# EAGLE schematic esp-module-cu (EAGLE 9.6.2)
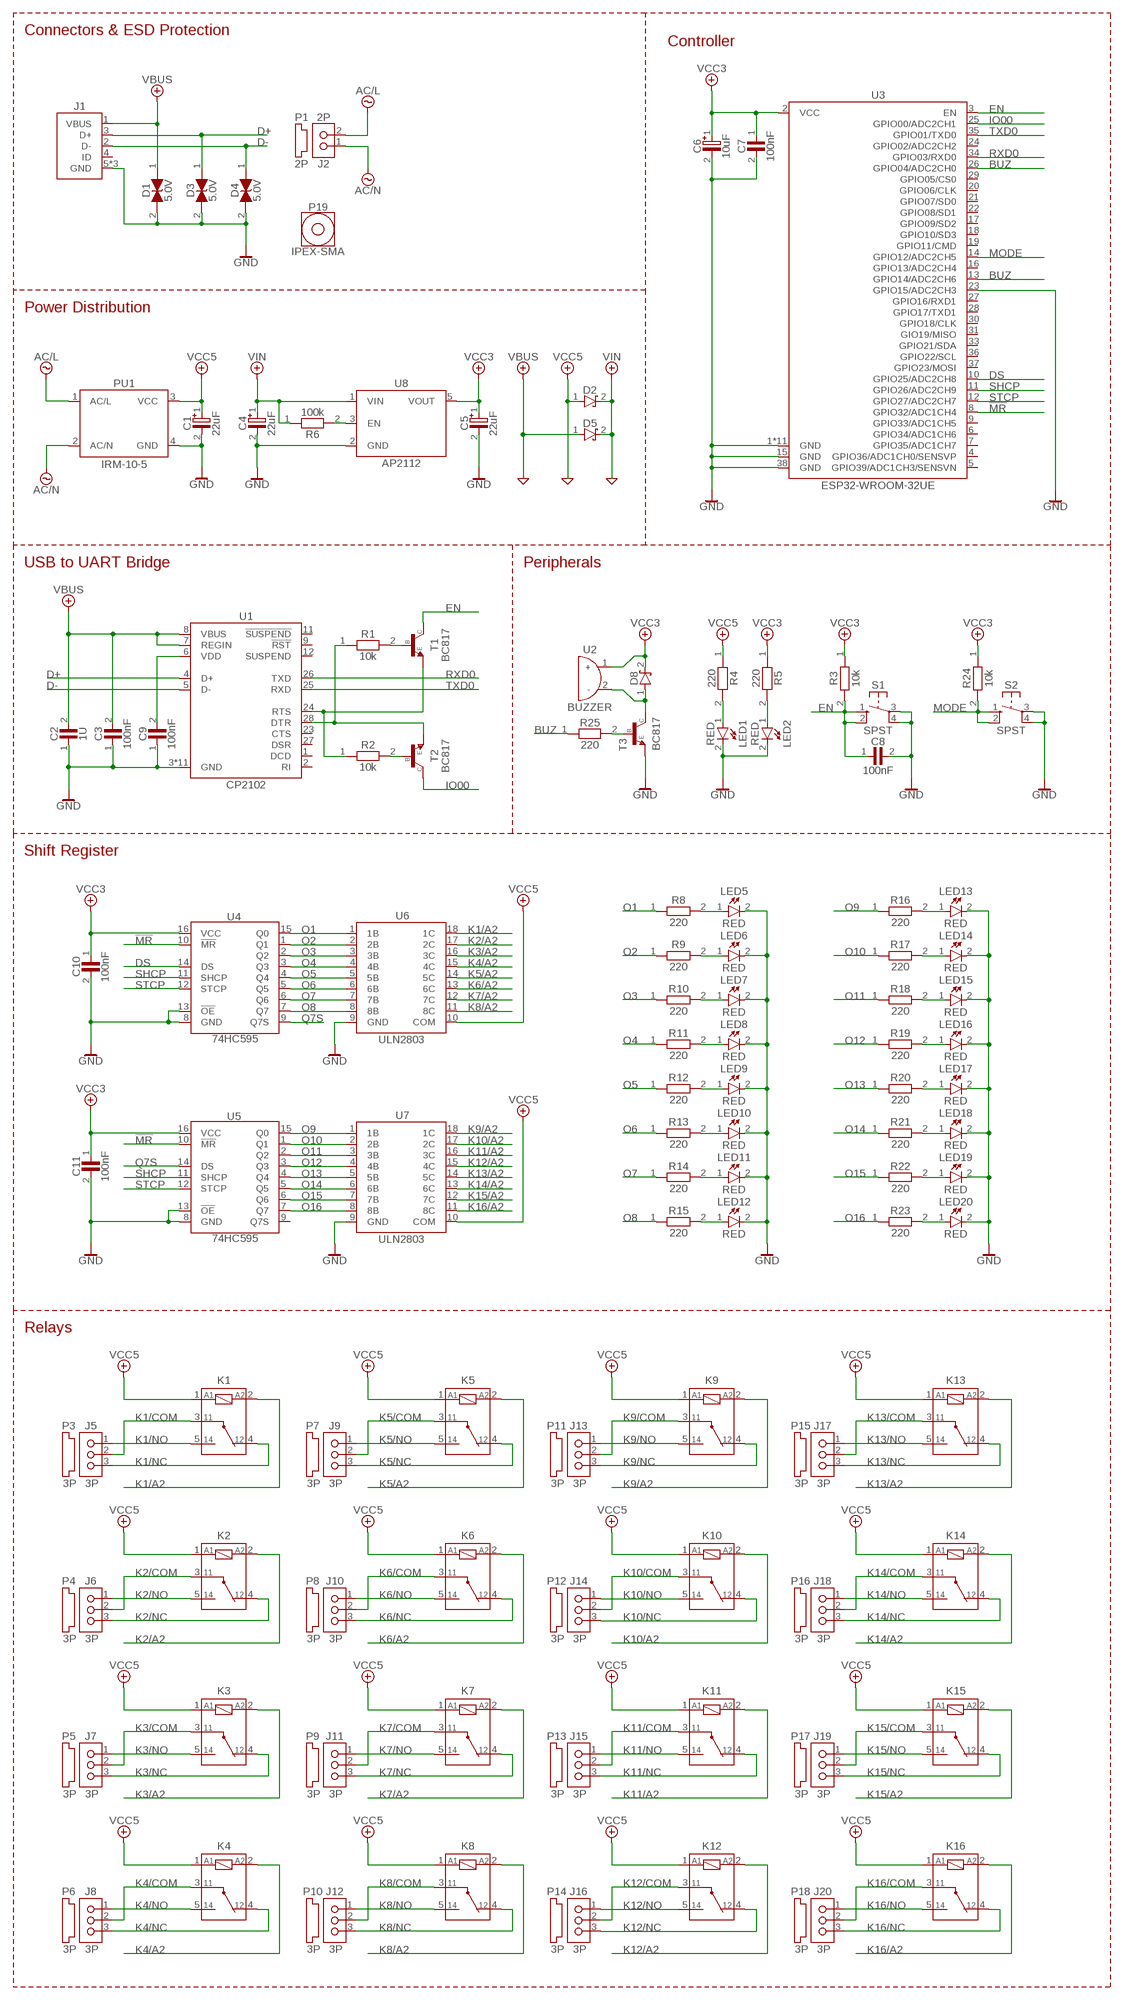
[diagram p0: schematic, sheet 1]

## Parts
C1  22uF  CAPACITOR-TANTALUM-22U-I1206-M3216  [I1206-M3216-D]
C2  1U  CAPACITOR-CERAMIC-1U-I0805-M2012  [I0805-M2012-C]
C3  100nF  CAPACITOR-CERAMIC-100N-I0805-M2012  [I0805-M2012-C]
C4  22uF  CAPACITOR-TANTALUM-22U-I1206-M3216  [I1206-M3216-D]
C5  22uF  CAPACITOR-TANTALUM-22U-I1206-M3216  [I1206-M3216-D]
C6  10uF  CAPACITOR-TANTALUM-10U-I1206-M3216  [I1206-M3216-D]
C7  100nF  CAPACITOR-CERAMIC-100N-I0805-M2012  [I0805-M2012-C]
C8  100nF  CAPACITOR-CERAMIC-100N-I0805-M2012  [I0805-M2012-C]
C9  100nF  CAPACITOR-CERAMIC-100N-I0805-M2012  [I0805-M2012-C]
C10  100nF  CAPACITOR-CERAMIC-100N-I0805-M2012  [I0805-M2012-C]
C11  100nF  CAPACITOR-CERAMIC-100N-I0805-M2012  [I0805-M2012-C]
D1  5.0V  ZENER-BI-5.0V-SOD-523  [SOD-523]
D2  30V  SCHOTTKY-30V-SOD-323  [SOD-323]
D3  5.0V  ZENER-BI-5.0V-SOD-523  [SOD-523]
D4  5.0V  ZENER-BI-5.0V-SOD-523  [SOD-523]
D5  30V  SCHOTTKY-30V-SOD-323  [SOD-323]
D8  30V  SCHOTTKY-30V-SOD-323  [SOD-323]
J1  USB-A-MICRO-TOP  [USB-A-MICRO-TOP]
J2  2P  HEADER-02P-1R-KF2EDGV-5.08-2P  [KF2EDGV-5.08-2P]
J5  3P  HEADER-03P-1R-KF2EDGV-5.08-3P  [KF2EDGV-5.08-3P]
J6  3P  HEADER-03P-1R-KF2EDGV-5.08-3P  [KF2EDGV-5.08-3P]
J7  3P  HEADER-03P-1R-KF2EDGV-5.08-3P  [KF2EDGV-5.08-3P]
J8  3P  HEADER-03P-1R-KF2EDGV-5.08-3P  [KF2EDGV-5.08-3P]
J9  3P  HEADER-03P-1R-KF2EDGV-5.08-3P  [KF2EDGV-5.08-3P]
J10  3P  HEADER-03P-1R-KF2EDGV-5.08-3P  [KF2EDGV-5.08-3P]
J11  3P  HEADER-03P-1R-KF2EDGV-5.08-3P  [KF2EDGV-5.08-3P]
J12  3P  HEADER-03P-1R-KF2EDGV-5.08-3P  [KF2EDGV-5.08-3P]
J13  3P  HEADER-03P-1R-KF2EDGV-5.08-3P  [KF2EDGV-5.08-3P]
J14  3P  HEADER-03P-1R-KF2EDGV-5.08-3P  [KF2EDGV-5.08-3P]
J15  3P  HEADER-03P-1R-KF2EDGV-5.08-3P  [KF2EDGV-5.08-3P]
J16  3P  HEADER-03P-1R-KF2EDGV-5.08-3P  [KF2EDGV-5.08-3P]
J17  3P  HEADER-03P-1R-KF2EDGV-5.08-3P  [KF2EDGV-5.08-3P]
J18  3P  HEADER-03P-1R-KF2EDGV-5.08-3P  [KF2EDGV-5.08-3P]
J19  3P  HEADER-03P-1R-KF2EDGV-5.08-3P  [KF2EDGV-5.08-3P]
J20  3P  HEADER-03P-1R-KF2EDGV-5.08-3P  [KF2EDGV-5.08-3P]
K1  5V  RELAY-SPDT-5V-SRD  [SRD]
K2  5V  RELAY-SPDT-5V-SRD  [SRD]
K3  5V  RELAY-SPDT-5V-SRD  [SRD]
K4  5V  RELAY-SPDT-5V-SRD  [SRD]
K5  5V  RELAY-SPDT-5V-SRD  [SRD]
K6  5V  RELAY-SPDT-5V-SRD  [SRD]
K7  5V  RELAY-SPDT-5V-SRD  [SRD]
K8  5V  RELAY-SPDT-5V-SRD  [SRD]
K9  5V  RELAY-SPDT-5V-SRD  [SRD]
K10  5V  RELAY-SPDT-5V-SRD  [SRD]
K11  5V  RELAY-SPDT-5V-SRD  [SRD]
K12  5V  RELAY-SPDT-5V-SRD  [SRD]
K13  5V  RELAY-SPDT-5V-SRD  [SRD]
K14  5V  RELAY-SPDT-5V-SRD  [SRD]
K15  5V  RELAY-SPDT-5V-SRD  [SRD]
K16  5V  RELAY-SPDT-5V-SRD  [SRD]
LED1  RED  LED-RED-I0805-M2012  [I0805-M2012-D]
LED2  RED  LED-RED-I0805-M2012  [I0805-M2012-D]
LED5  RED  LED-RED-I0805-M2012  [I0805-M2012-D]
LED6  RED  LED-RED-I0805-M2012  [I0805-M2012-D]
LED7  RED  LED-RED-I0805-M2012  [I0805-M2012-D]
LED8  RED  LED-RED-I0805-M2012  [I0805-M2012-D]
LED9  RED  LED-RED-I0805-M2012  [I0805-M2012-D]
LED10  RED  LED-RED-I0805-M2012  [I0805-M2012-D]
LED11  RED  LED-RED-I0805-M2012  [I0805-M2012-D]
LED12  RED  LED-RED-I0805-M2012  [I0805-M2012-D]
LED13  RED  LED-RED-I0805-M2012  [I0805-M2012-D]
LED14  RED  LED-RED-I0805-M2012  [I0805-M2012-D]
LED15  RED  LED-RED-I0805-M2012  [I0805-M2012-D]
LED16  RED  LED-RED-I0805-M2012  [I0805-M2012-D]
LED17  RED  LED-RED-I0805-M2012  [I0805-M2012-D]
LED18  RED  LED-RED-I0805-M2012  [I0805-M2012-D]
LED19  RED  LED-RED-I0805-M2012  [I0805-M2012-D]
LED20  RED  LED-RED-I0805-M2012  [I0805-M2012-D]
P1  2P  CONNECTOR-02P-1R-KF2EDGK-5.08  [CONNECTOR-DEFAULT]
P3  3P  CONNECTOR-03P-1R-KF2EDGK-5.08  [CONNECTOR-DEFAULT]
P4  3P  CONNECTOR-03P-1R-KF2EDGK-5.08  [CONNECTOR-DEFAULT]
P5  3P  CONNECTOR-03P-1R-KF2EDGK-5.08  [CONNECTOR-DEFAULT]
P6  3P  CONNECTOR-03P-1R-KF2EDGK-5.08  [CONNECTOR-DEFAULT]
P7  3P  CONNECTOR-03P-1R-KF2EDGK-5.08  [CONNECTOR-DEFAULT]
P8  3P  CONNECTOR-03P-1R-KF2EDGK-5.08  [CONNECTOR-DEFAULT]
P9  3P  CONNECTOR-03P-1R-KF2EDGK-5.08  [CONNECTOR-DEFAULT]
P10  3P  CONNECTOR-03P-1R-KF2EDGK-5.08  [CONNECTOR-DEFAULT]
P11  3P  CONNECTOR-03P-1R-KF2EDGK-5.08  [CONNECTOR-DEFAULT]
P12  3P  CONNECTOR-03P-1R-KF2EDGK-5.08  [CONNECTOR-DEFAULT]
P13  3P  CONNECTOR-03P-1R-KF2EDGK-5.08  [CONNECTOR-DEFAULT]
P14  3P  CONNECTOR-03P-1R-KF2EDGK-5.08  [CONNECTOR-DEFAULT]
P15  3P  CONNECTOR-03P-1R-KF2EDGK-5.08  [CONNECTOR-DEFAULT]
P16  3P  CONNECTOR-03P-1R-KF2EDGK-5.08  [CONNECTOR-DEFAULT]
P17  3P  CONNECTOR-03P-1R-KF2EDGK-5.08  [CONNECTOR-DEFAULT]
P18  3P  CONNECTOR-03P-1R-KF2EDGK-5.08  [CONNECTOR-DEFAULT]
P19  IPEX-SMA  [SMA]
PU1  IRM-10-5  POWER-SUPPLY-5V-IRM-10  [IRM-10]
R1  10k  RESISTOR-10K-I0805-M2012  [I0805-M2012-R]
R2  10k  RESISTOR-10K-I0805-M2012  [I0805-M2012-R]
R3  10k  RESISTOR-10K-I0805-M2012  [I0805-M2012-R]
R4  220  RESISTOR-220-I0805-M2012  [I0805-M2012-R]
R5  220  RESISTOR-220-I0805-M2012  [I0805-M2012-R]
R6  100k  RESISTOR-100K-I0805-M2012  [I0805-M2012-R]
R8  220  RESISTOR-220-I0805-M2012  [I0805-M2012-R]
R9  220  RESISTOR-220-I0805-M2012  [I0805-M2012-R]
R10  220  RESISTOR-220-I0805-M2012  [I0805-M2012-R]
R11  220  RESISTOR-220-I0805-M2012  [I0805-M2012-R]
R12  220  RESISTOR-220-I0805-M2012  [I0805-M2012-R]
R13  220  RESISTOR-220-I0805-M2012  [I0805-M2012-R]
R14  220  RESISTOR-220-I0805-M2012  [I0805-M2012-R]
R15  220  RESISTOR-220-I0805-M2012  [I0805-M2012-R]
R16  220  RESISTOR-220-I0805-M2012  [I0805-M2012-R]
R17  220  RESISTOR-220-I0805-M2012  [I0805-M2012-R]
R18  220  RESISTOR-220-I0805-M2012  [I0805-M2012-R]
R19  220  RESISTOR-220-I0805-M2012  [I0805-M2012-R]
R20  220  RESISTOR-220-I0805-M2012  [I0805-M2012-R]
R21  220  RESISTOR-220-I0805-M2012  [I0805-M2012-R]
R22  220  RESISTOR-220-I0805-M2012  [I0805-M2012-R]
R23  220  RESISTOR-220-I0805-M2012  [I0805-M2012-R]
R24  10k  RESISTOR-10K-I0805-M2012  [I0805-M2012-R]
R25  220  RESISTOR-220-I0805-M2012  [I0805-M2012-R]
S1  SPST  SWITCH-12V-50MA  [SMD-SW-4]
S2  SPST  SWITCH-12V-50MA  [SMD-SW-4]
T1  BC817  TRANSISTOR-NPN-SOT-23-3  [SOT-23-3]
T2  BC817  TRANSISTOR-NPN-SOT-23-3  [SOT-23-3]
T3  BC817  TRANSISTOR-NPN-SOT-23-3  [SOT-23-3]
U1  CP2102  CP2102-QFN-28  [QFN-28]
U2  BUZZER  [SMD-BUZZER]
U3  ESP32-WROOM-32UE  [ESP32-WROOM-32UE]
U4  74HC595  74HC595-SOIC-16  [SOIC-16]
U5  74HC595  74HC595-SOIC-16  [SOIC-16]
U6  ULN2803  ULN2803A-SOIC-18  [SOIC-18]
U7  ULN2803  ULN2803A-SOIC-18  [SOIC-18]
U8  AP2112  AP2112-SOT-25-5  [SOT-25-5]

## Nets
!MR: U3.8(GPIO32/ADC1CH4) U4.10(!MR) U5.10(!MR)
APEN: R6.2 U8.3(EN)
BUZ: R25.1 U3.13(GPIO14/ADC2CH6) U3.26(GPIO04/ADC2CH0)
BZB: R25.2 T3.1(B)
BZC: D8.1(A) T3.3(C) U2.2(-)
D+: D3.1(A) J1.3(D+) U1.4(D+)
D-: D4.1(A) J1.2(D-) U1.5(D-)
DS: U3.10(GPIO25/ADC2CH8) U4.14(DS)
DTR1: R1.1 T2.2(E) U1.28(DTR)
DTRT1: R1.2 T1.1(B)
EN: C8.1 R3.2 S1.1 S1.2 T1.3(C) U3.3(EN)
GND: C1.2(-) C2.1 C3.1 C4.2(-) C5.2(-) C6.2(-) C7.2 C8.2 C9.1 C10.2 C11.2 D1.2(C) D3.2(C) D4.2(C) J1.5(GND) J1.6(GND) J1.7(GND) LED1.2(C) LED2.2(C) LED5.2(C) LED6.2(C) LED7.2(C) LED8.2(C) LED9.2(C) LED10.2(C) LED11.2(C) LED12.2(C) LED13.2(C) LED14.2(C) LED15.2(C) LED16.2(C) LED17.2(C) LED18.2(C) LED19.2(C) LED20.2(C) PU1.4(GND) S1.3 S1.4 S2.3 S2.4 T3.2(E) U1.3(GND) U1.29(GND) U1.30(GND) U1.31(GND) U1.32(GND) U1.33(GND) U1.34(GND) U1.35(GND) U1.36(GND) U1.37(GND) U1.38(GND) U3.1(GND) U3.15(GND) U3.23(GPIO15/ADC2CH3) U3.38(GND) U3.39(GND) U3.40(GND) U3.41(GND) U3.42(GND) U3.43(GND) U3.44(GND) U3.45(GND) U3.46(GND) U3.47(GND) U3.48(GND) U4.8(GND) U4.13(!OE) U5.8(GND) U5.13(!OE) U6.9(GND) U7.9(GND) U8.2(GND)
IO00: T2.3(C) U3.25(GPIO00/ADC2CH1)
K1/A2: K1.2(A2) U6.18(1C)
K1/COM: J5.2 K1.3
K1/NC: J5.3 K1.4
K1/NO: J5.1 K1.5
K1LED: LED5.1(A) R8.2
K2/A2: K2.2(A2) U6.17(2C)
K2/COM: J6.2 K2.3
K2/NC: J6.3 K2.4
K2/NO: J6.1 K2.5
K2LED1: LED6.1(A) R9.2
K3/A2: K3.2(A2) U6.16(3C)
K3/COM: J7.2 K3.3
K3/NC: J7.3 K3.4
K3/NO: J7.1 K3.5
K3LED1: LED7.1(A) R10.2
K4/A2: K4.2(A2) U6.15(4C)
K4/COM: J8.2 K4.3
K4/NC: J8.3 K4.4
K4/NO: J8.1 K4.5
K4LED1: LED8.1(A) R11.2
K5/A2: K5.2(A2) U6.14(5C)
K5/COM: J9.2 K5.3
K5/NC: J9.3 K5.4
K5/NO: J9.1 K5.5
K5LED1: LED9.1(A) R12.2
K6/A2: K6.2(A2) U6.13(6C)
K6/COM: J10.2 K6.3
K6/NC: J10.3 K6.4
K6/NO: J10.1 K6.5
K6LED1: LED10.1(A) R13.2
K7/A2: K7.2(A2) U6.12(7C)
K7/COM: J11.2 K7.3
K7/NC: J11.3 K7.4
K7/NO: J11.1 K7.5
K7LED1: LED11.1(A) R14.2
K8/A2: K8.2(A2) U6.11(8C)
K8/COM: J12.2 K8.3
K8/NC: J12.3 K8.4
K8/NO: J12.1 K8.5
K8LED1: LED12.1(A) R15.2
K9/A2: K9.2(A2) U7.18(1C)
K9/COM: J13.2 K9.3
K9/NC: J13.3 K9.4
K9/NO: J13.1 K9.5
K09LED: LED13.1(A) R16.2
K10/A2: K10.2(A2) U7.17(2C)
K10/COM: J14.2 K10.3
K10/NC: J14.3 K10.4
K10/NO: J14.1 K10.5
K10LED: LED14.1(A) R17.2
K11/A2: K11.2(A2) U7.16(3C)
K11/COM: J15.2 K11.3
K11/NC: J15.3 K11.4
K11/NO: J15.1 K11.5
K11LED: LED15.1(A) R18.2
K12/A2: K12.2(A2) U7.15(4C)
K12/COM: J16.2 K12.3
K12/NC: J16.3 K12.4
K12/NO: J16.1 K12.5
K12LED: LED16.1(A) R19.2
K13/A2: K13.2(A2) U7.14(5C)
K13/COM: J17.2 K13.3
K13/NC: J17.3 K13.4
K13/NO: J17.1 K13.5
K13LED: LED17.1(A) R20.2
K14/A2: K14.2(A2) U7.13(6C)
K14/COM: J18.2 K14.3
K14/NC: J18.3 K14.4
K14/NO: J18.1 K14.5
K14LED: LED18.1(A) R21.2
K15/A2: K15.2(A2) U7.12(7C)
K15/COM: J19.2 K15.3
K15/NC: J19.3 K15.4
K15/NO: J19.1 K15.5
K15LED: LED19.1(A) R22.2
K16/A2: K16.2(A2) U7.11(8C)
K16/COM: J20.2 K16.3
K16/NC: J20.3 K16.4
K16/NO: J20.1 K16.5
K16LED: LED20.1(A) R23.2
L: J2.2 PU1.1(AC/L) ; supply symbol labelled AC/L
MODE: R24.2 S2.1 S2.2 U3.14(GPIO12/ADC2CH5)
N: J2.1 PU1.2(AC/N) ; supply symbol labelled AC/N
O1: R8.1 U4.15(Q0) U6.1(1B)
O2: R9.1 U4.1(Q1) U6.2(2B)
O3: R10.1 U4.2(Q2) U6.3(3B)
O4: R11.1 U4.3(Q3) U6.4(4B)
O5: R12.1 U4.4(Q4) U6.5(5B)
O6: R13.1 U4.5(Q5) U6.6(6B)
O7: R14.1 U4.6(Q6) U6.7(7B)
O8: R15.1 U4.7(Q7) U6.8(8B)
O9: R16.1 U5.15(Q0) U7.1(1B)
O10: R17.1 U5.1(Q1) U7.2(2B)
O11: R18.1 U5.2(Q2) U7.3(3B)
O12: R19.1 U5.3(Q3) U7.4(4B)
O13: R20.1 U5.4(Q4) U7.5(5B)
O14: R21.1 U5.5(Q5) U7.6(6B)
O15: R22.1 U5.6(Q6) U7.7(7B)
O16: R23.1 U5.7(Q7) U7.8(8B)
Q7S: U4.9(Q7S) U5.14(DS)
RTS1: R2.1 T1.2(E) U1.24(RTS)
RTST1: R2.2 T2.1(B)
RXD0: U1.26(TXD) U3.34(GPIO03/RXD0)
SHCP: U3.11(GPIO26/ADC2CH9) U4.11(SHCP) U5.11(SHCP)
STCP: U3.12(GPIO27/ADC2CH7) U4.12(STCP) U5.12(STCP)
TXD0: U1.25(RXD) U3.35(GPIO01/TXD0)
VBUS: C2.2 C3.2 D1.1(A) D5.1(A) J1.1(VBUS) U1.7(REGIN) U1.8(VBUS)
VCC3: C5.1(+) C6.1(+) C7.1 C10.1 C11.1 D8.2(C) R3.1 R5.1 R24.1 U2.1(+) U3.2(VCC) U4.16(VCC) U5.16(VCC) U8.5(VOUT)
VCC5: C1.1(+) D2.1(A) K1.1(A1) K2.1(A1) K3.1(A1) K4.1(A1) K5.1(A1) K6.1(A1) K7.1(A1) K8.1(A1) K9.1(A1) K10.1(A1) K11.1(A1) K12.1(A1) K13.1(A1) K14.1(A1) K15.1(A1) K16.1(A1) PU1.3(VCC) R4.1 U6.10(COM) U7.10(COM)
VCCLED1: LED2.1(A) R5.2
VCCLED2: LED1.1(A) R4.2
VDD: C9.2 U1.6(VDD)
VIN: C4.1(+) D2.2(C) D5.2(C) R6.1 U8.1(VIN)
Unconnected: J1.4(ID) U1.1(DCD) U1.2(RI) U1.9(!RST) U1.11(!SUSPEND) U1.12(SUSPEND) U1.23(CTS) U1.27(DSR) U3.4(GPIO36/ADC1CH0/SENSVP) U3.5(GPIO39/ADC1CH3/SENSVN) U3.6(GPIO34/ADC1CH6) U3.7(GPIO35/ADC1CH7) U3.9(GPIO33/ADC1CH5) U3.16(GPIO13/ADC2CH4) U3.17(GPIO09/SD2) U3.18(GPIO10/SD3) U3.19(GPIO11/CMD) U3.20(GPIO06/CLK) U3.21(GPIO07/SD0) U3.22(GPIO08/SD1) U3.24(GPIO02/ADC2CH2) U3.27(GPIO16/RXD1) U3.28(GPIO17/TXD1) U3.29(GPIO05/CS0) U3.30(GPIO18/CLK) U3.31(GIO19/MISO) U3.33(GPIO21/SDA) U3.36(GPIO22/SCL) U3.37(GPIO23/MOSI) U5.9(Q7S)

## Notes on the sheet
- Connectors & ESD Protection
- Controller
- Power Distribution
- USB to UART Bridge | Peripherals
- Shift Register
- Relays

## Library data of the parts
C1 C4 C5 = deiring-components:CAPACITOR-TANTALUM: Capacitors Tantalum; LCSC: C11366; MF: Kyocera AVX; MPN: TAJA226K010RNJ; VOLTAGE: 10V
C2 = deiring-components:CAPACITOR-CERAMIC: Capacitors Multilayer Ceramic; LCSC: C215803; MF: FH (Guangdong Fenghua Advanced Tech); MPN: 0805B105K500NT; TOLERANCE: 10%; VOLTAGE: 50V
C3 C7-C11 = deiring-components:CAPACITOR-CERAMIC: Capacitors Multilayer Ceramic; LCSC: C38141; MF: FH (Guangdong Fenghua Advanced Tech); MPN: 0805B104K500NT; TOLERANCE: 10%; VOLTAGE: 50V
C6 = deiring-components:CAPACITOR-TANTALUM: Capacitors Tantalum; LCSC: C7171; MF: Kyocera AVX; MPN: TAJA106K016RNJ; VOLTAGE: 16V
D1 D3 D4 = deiring-components:ZENER-BI: Zener Diode; LCSC: C383211; MF: LRC; MPN: LESD5D5.0CT1G
D2 D5 D8 = deiring-components:SCHOTTKY: Shottky Barrier Diodes; LCSC: C124187; MF: Diodes Incorporated; MPN: BAT760-7
J1 = deiring-components:USB-A: USB Micro-B Connector; LCSC: C437032; MF: XKB Connectivity; MPN: U255-051N-4BH70-FS
J2 = deiring-components:HEADER-02P-1R: Header 2 Pin 1 Row; LCSC: C441354; MF: Cixi Kefa Elec; MPN: KF2EDGV-5.08-2P
J5-J20 = deiring-components:HEADER-03P-1R: Header 3 Pin 1 Row; LCSC: C441355; MF: Cixi Kefa Elec; MPN: KF2EDGV-5.08-3P
K1-K16 = deiring-components:RELAY-SPDT: General Purpose Non Latching Relays; LCSC: C35449; MF: Ningbo Songle Relay; MPN: SRD-05VDC-SL-C
LED1 LED2 LED5-LED20 = deiring-components:LED: Light Emitting Diodes; LCSC: C84256; MF: Foshan NationStar Optoelectronics; MPN: FC-2012HRK-620D
P1 = deiring-components:CONNECTOR-02P-1R: Plug 2 Pin 1 Row; LCSC: C440880; MF: Cixi Kefa Elec; MPN: KF2EDGK-5.08-2P
P3-P18 = deiring-components:CONNECTOR-03P-1R: Plug 3 Pin 1 Row; LCSC: C440881; MF: Cixi Kefa Elec; MPN: KF2EDGK-5.08-3P
P19 = deiring-components:IPEX-SMA: Radio Frequency Cable; LCSC: C1509178; MF: HJ-IPEX1-SMA-RG1.13-35mm; MPN: HJ Tech
PU1 = deiring-components:POWER-SUPPLY: Single Output Encapsulated Power Supply; MF: Mean Well; MPN: IRM-10-5; WATTAGE: 10W
R1-R3 R24 = deiring-components:RESISTOR: Chip Resistor; LCSC: C17414; MF: UNI-ROYAL(Uniroyal Elec); MPN: 0805W8F1002T5E; WATTAGE: 1/8W
R4 R5 R8-R23 R25 = deiring-components:RESISTOR: Chip Resistor; LCSC: C17557; MF: UNI-ROYAL(Uniroyal Elec); MPN: 0805W8F2200T5E; WATTAGE: 1/8W
R6 = deiring-components:RESISTOR: Chip Resistor; LCSC: C149504; MF: UNI-ROYAL(Uniroyal Elec); MPN: 0805W8F1003T5E; WATTAGE: 1/8W
S1 S2 = deiring-components:SWITCH: Tactile Switch SPST; LCSC: C318884; MF: XKB Enterprise; MPN: TS-1187A-B-A-B; VOLTAGE: 12V
T1-T3 = deiring-components:TRANSISTOR-NPN: NPN General-Ourpose Transistors; LCSC: C52801; MF: Nexperia; MPN: BC817-40,215
U1 = deiring-components:CP2102: Single-Chip USB to UART Bridge; LCSC: C6568; MF: SILICON LABS; MPN: CP2102-GMR
U2 = deiring-components:BUZZER: Externally Driven Buzzer; LCSC: C95299; MF: MLT-7525; MPN: Jiangsu Huaneng Elec
U3 = deiring-components:ESP32-WROOM: ESP WROOM 32; LCSC: C701346; MF: Espressif Systems; MPN: ESP32-WROOM-32UE-N16; VALUES: ESP32
U4 U5 = deiring-components:74HC595: Shifting Register; LCSC: C5947; MF: 74HC595D,118; MPN: Nexperia
U6 U7 = deiring-components:ULN2803A: Darlington Transitor Array Driver; LCSC: C2758014; MF: Texas Instruments; MPN: ULN2803
U8 = deiring-components:AP2112: Linear Voltage Regulators; LCSC: C3021085; MF: TECH PUBLIC; MPN: TPAP2112K-3.3TRG1